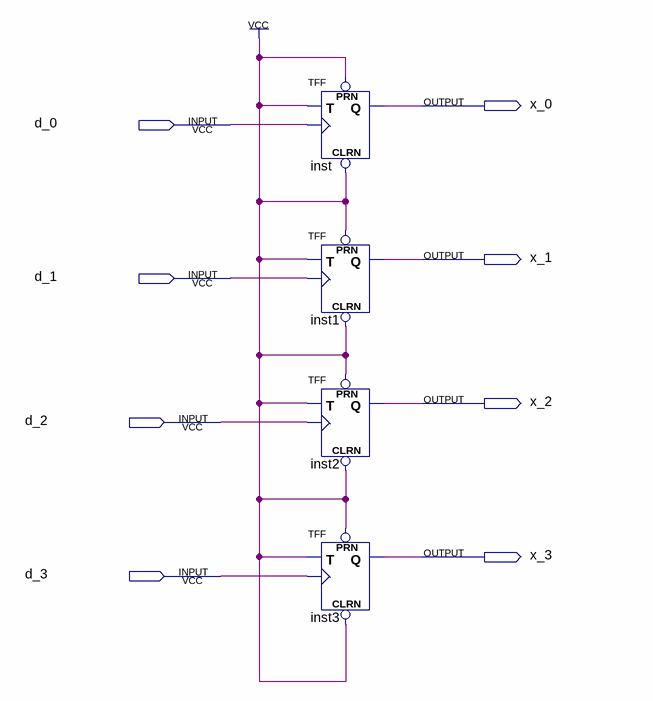
[diagram p0: schematic sheet]
// Quartus schematic Eingangsspeicher.bdf as structural Verilog: 4 symbols, 8 pins
module Eingangsspeicher (
  input  d_0,
  input  d_1,
  input  d_2,
  input  d_3,
  output x_0,
  output x_1,
  output x_2,
  output x_3
);

  TFF inst (.PRN(1'b1), .CLRN(1'b1), .T(1'b1), .CLK(d_0), .Q(x_0));
  TFF inst1 (.PRN(1'b1), .CLRN(1'b1), .T(1'b1), .CLK(d_1), .Q(x_1));
  TFF inst2 (.PRN(1'b1), .CLRN(1'b1), .T(1'b1), .CLK(d_2), .Q(x_2));
  TFF inst3 (.PRN(1'b1), .CLRN(1'b1), .T(1'b1), .CLK(d_3), .Q(x_3));
endmodule
